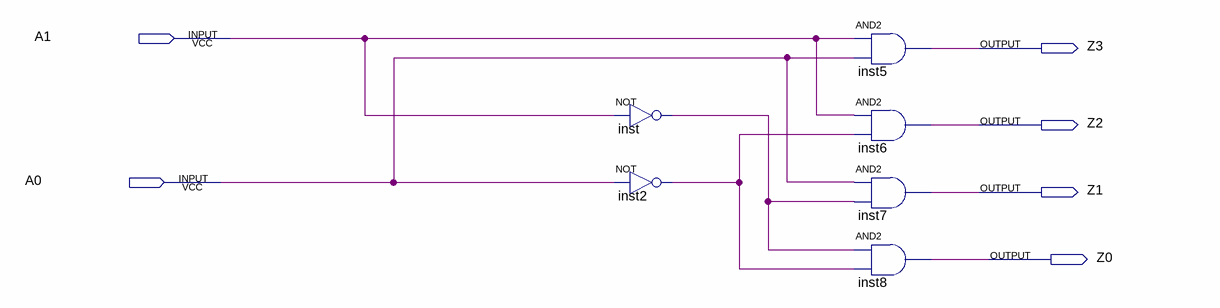
[diagram p0: schematic sheet]
// Quartus schematic 24DECODER.bdf as structural Verilog: 6 symbols, 6 pins
module \24DECODER  (
  input  A1,
  input  A0,
  output Z3,
  output Z2,
  output Z1,
  output Z0
);

  wire inst2_out, inst_out;

  not inst (inst_out, A1);
  not inst2 (inst2_out, A0);
  and inst5 (Z3, A1, A0);
  and inst6 (Z2, A1, inst2_out);
  and inst7 (Z1, A0, inst_out);
  and inst8 (Z0, inst_out, inst2_out);
endmodule
